# Altium schematic sheet Sheet1.SchDoc
size A4
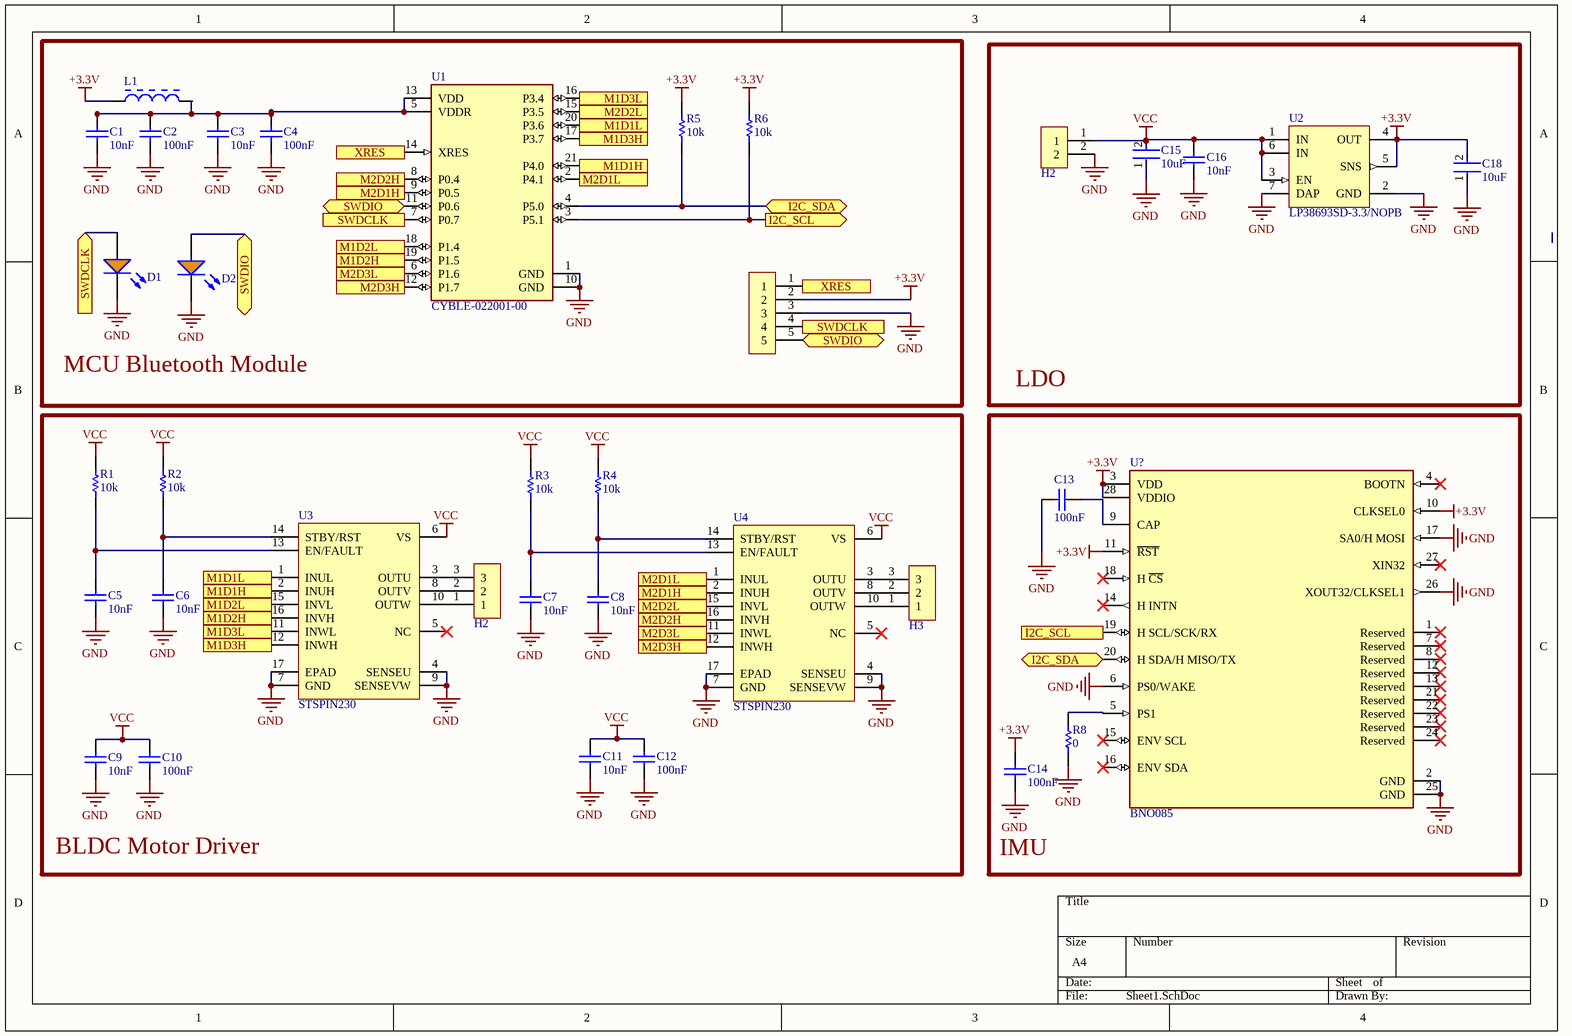
[diagram p0: Sheet1.SchDoc]

## Parts
(Parts that share a designator on the sheet are numbered #1, #2 ... from top to bottom, then left to right.)
C1  10nF  [CAPC1005X56X25ML10T15]
C2  100nF  [CAPC1005X56X25ML10T15]
C3  10nF  [CAPC1005X56X25ML10T15]
C4  100nF  [CAPC1005X56X25ML10T15]
C5  10nF  [CAPC1005X56X25ML10T15]
C6  10nF  [CAPC1005X56X25ML10T15]
C7  10nF  [CAPC1005X56X25ML10T15]
C8  10nF  [CAPC1005X56X25ML10T15]
C9  10nF  [CAPC1005X56X25ML10T15]
C10  100nF  [CAPC1005X56X25ML10T15]
C11  10nF  [CAPC1005X56X25ML10T15]
C12  100nF  [CAPC1005X56X25ML10T15]
C13  100nF  [CAPC1005X56X25ML10T15]
C14  100nF  [CAPC1005X56X25ML10T15]
C15  10uF  [FP-CL21B106KOQNNNE-MFG]
C16  10nF  [CAPC1005X56X25ML10T15]
C18  10uF  [FP-CL21B106KOQNNNE-MFG]
D1  HSMD-C190  [AVAG-HSMX-C190_V]  (value not drawn)
D2  HSMD-C190  [AVAG-HSMX-C190_V]  (value not drawn)
H1  H5P2.54  [T5P2.54]  (value not drawn)
H2#1  H2P2.54  [T2P2.54]  (value not drawn)
H2#2  H3P2.54  [H3P2.54 V]  (value not drawn)
H3  H3P2.54  [H3P2.54 V]  (value not drawn)
L1  BLM18AG331SN1D  [MURA-BLM18-RF-H4-CHIP-2_V]  (value not drawn)
R1  10k  [RESC1005X40X25ML5T10]
R2  10k  [RESC1005X40X25ML5T10]
R3  10k  [RESC1005X40X25ML5T10]
R4  10k  [RESC1005X40X25ML5T10]
R5  10k  [RESC1005X40X25ML5T10]
R6  10k  [RESC1005X40X25ML5T10]
R8  0  [RESC1005X40X25ML5T10]
U1  CYBLE-022001-00  [FP-CYBLE-022001-00-MFG]
U2  LP38693SD-3.3/NOPB  [NGG0006A_V]
U3  STSPIN230  [QFN50P300X300X100_HS-17N]
U4  STSPIN230  [QFN50P300X300X100_HS-17N]
U?  BNO085  [FP-BNO085-MFG]

## Blocks framed on the sheet
MCU Bluetooth Module: C1-C4 D1 D2 H1 L1 R5 R6 U1
LDO: C15 C16 C18 H2#1 U2
BLDC Motor Driver: C5-C12 H2#2 H3 R1-R4 U3 U4
IMU: C13 C14 R8 U?

## Ports
I2C_SCL (in), I2C_SCL (out), I2C_SDA (bidir), M1D1H (in), M1D1H (out), M1D1L (in), M1D1L (out), M1D2H (in), M1D2H (out), M1D2L (in), M1D2L (out), M1D3H (in), M1D3H (out), M1D3L (in), M1D3L (out), M2D1H (in), M2D1H (out), M2D1L (in), M2D1L (out), M2D2H (in), M2D2H (out), M2D2L (in), M2D2L (out), M2D3H (in), M2D3H (out), M2D3L (in), M2D3L (out), SWDCLK (in), SWDCLK (out), SWDIO (bidir), XRES (in), XRES (out)

## Nets
+3.3V: C14.2 C18.2 H1.2 L1.1 R5.2 R6.2 U2.4(OUT) U2.5(SNS) U?.3(VDD) U?.10(CLKSEL0) U?.11(~{RST}) U?.28(VDDIO)
GND: C1.1 C2.1 C3.1 C4.1 C5.1 C6.1 C7.1 C8.1 C9.1 C10.1 C11.1 C12.1 C13.2 C14.1 C15.1 C16.1 C18.1 D1.2(K) D2.2(K) H1.3 H2#1.2 R8.1 U1.1(GND) U1.10(GND) U2.2(GND) U2.7(DAP) U3.4(SENSEU) U3.7(GND) U3.9(SENSEVW) U3.17(EPAD) U4.4(SENSEU) U4.7(GND) U4.9(SENSEVW) U4.17(EPAD) U?.2(GND) U?.6(PS0/WAKE) U?.17(SA0/H_MOSI) U?.25(GND) U?.26(XOUT32/CLKSEL1)
VCC: C9.2 C10.2 C11.2 C12.2 C15.2 C16.2 H2#1.1 R1.2 R2.2 R3.2 R4.2 U2.1(IN) U2.3(EN) U2.6(IN) U3.6(VS) U4.6(VS)
I2C_SCL: R6.1 U1.3(P5.1) U?.19(H_SCL/SCK/RX) ; port I2C_SCL
I2C_SDA: R5.1 U1.4(P5.0) U?.20(H_SDA/H_MISO/TX) ; port I2C_SDA
M1D1H: U1.21(P4.0) U3.2(INUH) ; port M1D1H
M1D1L: U1.20(P3.6) U3.1(INUL) ; port M1D1L
M1D2H: U1.19(P1.5) U3.16(INVH) ; port M1D2H
M1D2L: U1.18(P1.4) U3.15(INVL) ; port M1D2L
M1D3H: U1.17(P3.7) U3.12(INWH) ; port M1D3H
M1D3L: U1.16(P3.4) U3.11(INWL) ; port M1D3L
M2D1H: U1.9(P0.5) U4.2(INUH) ; port M2D1H
M2D1L: U1.2(P4.1) U4.1(INUL) ; port M2D1L
M2D2H: U1.8(P0.4) U4.16(INVH) ; port M2D2H
M2D2L: U1.15(P3.5) U4.15(INVL) ; port M2D2L
M2D3H: U1.12(P1.7) U4.12(INWH) ; port M2D3H
M2D3L: U1.6(P1.6) U4.11(INWL) ; port M2D3L
SWDCLK: D1.1(A) H1.4 U1.7(P0.7) ; port SWDCLK
SWDIO: D2.1(A) H1.5 U1.11(P0.6) ; port SWDIO
XRES: H1.1 U1.14(XRES) ; port XRES
NetC1_2: C1.2 C2.2 C3.2 C4.2 L1.2 U1.5(VDDR) U1.13(VDD)
NetC5_2: C5.2 R1.1 U3.13(EN/FAULT)
NetC6_2: C6.2 R2.1 U3.14(STBY/RST)
NetC7_2: C7.2 R3.1 U4.13(EN/FAULT)
NetC8_2: C8.2 R4.1 U4.14(STBY/RST)
NetC13_1: C13.1 U?.9(CAP)
NetH2#2_1: H2#2.1 U3.10(OUTW)
NetH2#2_2: H2#2.2 U3.8(OUTV)
NetH2#2_3: H2#2.3 U3.3(OUTU)
NetH3_1: H3.1 U4.10(OUTW)
NetH3_2: H3.2 U4.8(OUTV)
NetH3_3: H3.3 U4.3(OUTU)
NetR8_2: R8.2 U?.5(PS1)

Not connected (* = marked no-connect by the designer): U3 5(NC)*; U4 5(NC)*; U? 1(Reserved)* 4(BOOTN)* 7(Reserved)* 8(Reserved)* 12(Reserved)* 13(Reserved)* 14(H_INTN)* 15(ENV_SCL)* 16(ENV_SDA)* 18(H_~{CS})* 21(Reserved)* 22(Reserved)* 23(Reserved)* 24(Reserved)* 27(XIN32)*

## Library data of the parts
C1 C3 C5-C9 C11 C16 = CMP-2008-02799-1: 0402YC103MAT2A; Manufacturer: AVX Interconnect / Elco; Part Number: 0402YC103MAT2A
C2 C4 C13 C14 = CMP-2008-02800-1: 100nF / 0402YC104KAT2A; Manufacturer: AVX Interconnect / Elco; Part Number: 0402YC104KAT2A
C10 C12 = CMP-2008-02800-1: 0402YC104KAT2A; Manufacturer: AVX Interconnect / Elco; Part Number: 0402YC104KAT2A
C15 C18 = CMP-2000-06106-2: CAP CER 10UF 16V X7R 0805 - CL21B106KOQNNNE; Manufacturer: Samsung Electro-Mechanics America, Inc; Material: Ceramic; Tolerance: 10%; Temperature Coefficient: 15%; Digikey Description: CAP CER 10UF 16V X7R 0805; Lead Free: Yes; ComponentLink2URL: http://www.samsungsem.com/servlet/FileDownload?path=productsearch&sname=CL21B106KOQNNNE.pdf&oname=CL21B106KOQNNNE.pdf; ComponentLink2Description: Datasheet; Temperature Range Low: -55°C; RoHS: TRUE; Category: Cap; Temperature Characteristic: X7R; Manufacturer Part Number: CL21B106KOQNNNE; Automotive: No; Octopart: https://octopart.com/cl21b106koqnnne-samsung-19832289; Device Class L3: Ceramic Capacitors; Temperature Range High: +125°C; Height: 1.4mm; Device Class L2: Capacitors; Voltage Rating: 16V; Value: 10uF; Temperature: -55°C to +125°C; Device Class L1: Passive Components; Ipc Land Pattern Name: CAPC200125X125; Package: CL21B106KOQNNNE; Capacitance: 10uF
D1 D2 = CMP-007-00012-1: LED Uni-Color Orange, 52 mW, 20 mA, -40 to 85 degC, 2-Pin SMD, RoHS, Tape and Reel; Manufacturer: Avago; Luminous Intensity: 8mcd; Power: 52mW; Nominal Vf: 2.2V; Viewing Angle: 170degrees; Forward Current: 20mA; Lens Style: Diffused; Packaging: TapeandReel; Package Reference: HSMX-C190; Package Quantity: 4000; Colour: Orange; Datasheet URL: http://docs.avagotech.com/docs/AV02-0551EN; Pins: 2; Package Description: 2-Pin Surface Mount Device, Body 1.6 x 0.8 mm, Height 0.9 mm; Datasheet Version: Mar-12; RoHS Compliant: True; Min Operating Temperature: -40°C; Case/Package: 0603; Manufacturer URL: http://www.avagotech.com/; Max Operating Temperature: 85°C; Mounting Technology: SM; Illumination Colour: Orange; Forward Voltage: 2.2V
L1 = CMP-0686-00430-2: Chip Ferrite Bead for General Use, 330 Ohm, 500 mA, -55 to 125 degC, 1.6 x 0.8 x 0.95 mm SMD, Tape and Reel; Manufacturer: Murata; Impedance (at 100 MHz): 330 Ohm +/- 25%; Rated Current: 500 mA; DC Resistance: 0.30 Ohm Max.; PartNumber: BLM18AG331SN1D; ComponentLink3Description: Package Specification; PackageReference: BLM18_H950-2; DatasheetVersion: 08/2013; ComponentLink1URL: http://www.murata.com/; ComponentLink2Description: Datasheet; Mounting Technology: Surface Mount; Operating Temperature Range: -55 to 125 degC; Packing: Tape and Reel; ComponentLink1Description: Manufacturer URL; ComponentLink3URL: http://www.murata.com/products/catalog/pdf/c31e.pdf; PackageDescription: 2-Pin Chip, Body 1.6 x 0.8 mm; ComponentLink2URL: http://www.murata.com/products/catalog/pdf/c31e.pdf
R1-R6 R8 = CMP-2002-07915-2: Chip Resistor, 10 KOhm, +/- 5%, 0.063 W, -55 to 155 degC, 0402 (1005 Metric), RoHS, Tape and Reel - RC0402JR-0710KL; Resistance: 10 kohm; Voltage Rating (DC): 50 V; Power Rating: 63 mW; Case\Package: 0402; RoHSCompliant: true; DatasheetVersion: Rev. 4, 02/2016; ComponentLink1Description: Manufacturer URL; PackageDescription: 2-Pin Surface Mount Device, Body 1 x 0.5 mm; Case Code (Imperial): 0402; PackageReference: 0402; ComponentLink1URL: http://www.yageo.com/; Mounting Technology: Surface Mount; REACH SVHC: No SVHC; ComponentLink2Description: Datasheet; Case Code (Metric): 1005; Width: 0.5 mm; Package Quantity: 10000; Packaging: Tape and Reel; Max Operating Temperature: 155 degC; Mount: Surface Mount; Length: 1 mm; ComponentLink2URL: http://www.yageo.com/documents/recent/PYu-RC_Group_51_RoHS_L_04.pdf; Tolerance: 5%; Height: 0.35 mm; Voltage Rating: 50 V; Pins: 2; Min Operating Temperature: -55 degC
U1 = CMP-2000-05093-2: RX TXRX MOD BLUETOOTH CHIP SMD; Current - Transmitting: 15.6mA; Current - Receiving: 16.4mA; Interface: I2C; Frequency: 2.4GHz; Sensitivity: -91dBm; Max Supply Voltage: 5.5V; Memory Size: 16KB; Min Supply Voltage: 1.8V; Data Rate: 1Mbps; Min Operating Temperature: -40°C; Mount: Surface Mount; Max Operating Temperature: 85°C; Packaging: Tape and Reel; REACH SVHC: No SVHC; Case/Package: Module; Lead Free: Lead Free; Number of Pins: 21
U2 = CMP-0062-01530-4: 500mA Low Dropout CMOS Linear Regulators Stable with Ceramic Output Capacitors, 6-pin LLP, Pb-Free, 1000 Reel; Manufacturer: Texas Instruments; High-Reliability: Y; CompType: LDO IC; PackageTopMarking: ZXYTT*L130B; PackageReference: NGG0006A; PinCount: 6; RoHS: Y; ComponentLink1URL: http://www.ti.com/general/docs/lit/getliterature.tsp?genericPartNumber=LP38693&fileType=pdf; PowerWise: Y; PackageDescription: LLP, Plastic, Dual, 3 x 3 x 0.8mm Body, 6 Lead, 0.95mm Pitch, No Pullback; PartNumber: LP38693SD-3.3/NOPB; ComponentLink1Description: Datasheet URL
U? = CMP-197298-000001-1: IMU ACCEL/GYRO/MAG I2C 32BIT; Manufacturer: Hillcrest Laboratories, Inc.; Sensor Type: Accelerometer,Gyroscope,Magnetometer; Max Supply Voltage: 3.6V; Sensor Output: I2C,SPI,UART; Accel Range: 8g; Min Supply Voltage: 1.7V; Temperature Range High: +85°C; ComponentLink2URL: https://www.hillcrestlabs.com/download/5a747b8d566d073a5d000536; Octopart: https://octopart.com/bno085-hillcrest+laboratories-92813482; Height: 1.18mm; Device Class L1: Sensors; Digikey Description: IMU ACCEL/GYRO/MAG I2C 32BIT; Automotive: No; Package: BNO085; Device Class L3: Inertial Measurement Units (IMUs); Temperature: -40°C to +85°C; Category: IC; Device Class L2: Motion Sensors; Lead Free: Yes; Manufacturer Part Number: BNO085; Temperature Range Low: -40°C; RoHS: TRUE; ComponentLink2Description: Datasheet